# Altium schematic sheet uart.schdoc: UART
size A4; Date: 10.01.2026; CheckedBy: BCY; DrawnBy: miaow; Revision: v1.0.0; SheetNumber: 9; SheetTotal: 9; BoardType: MAIN_PCB; Desc: Debug & console
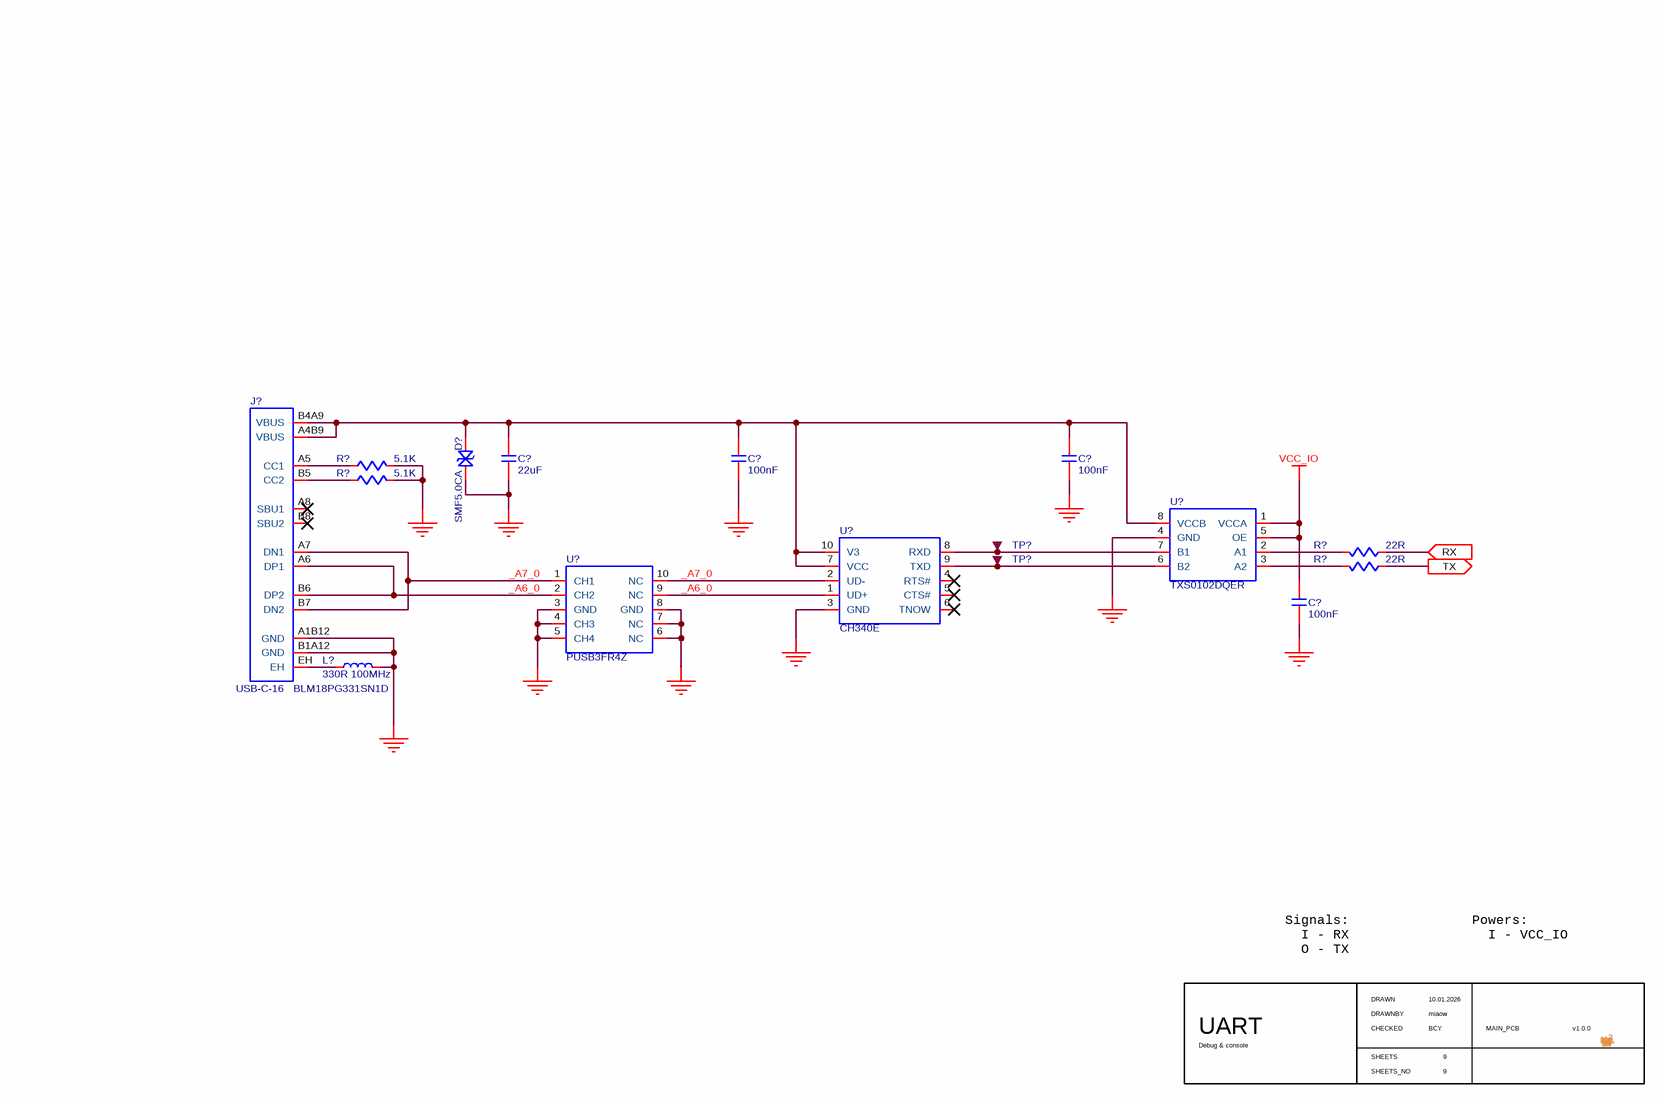
[diagram p0: uart.schdoc]

## Parts
(Parts that share a designator on the sheet are numbered #1, #2 ... from top to bottom, then left to right.)
C?#1  value 22uF  [C0603]  (hidden comment: C-NOMO)
C?#2  value 100nF  [C0402]  (hidden comment: C-NOMO)
C?#3  value 100nF  [C0402]  (hidden comment: C-NOMO)
C?#4  value 100nF  [C0402]  (hidden comment: C-NOMO)
D?  SMF5.0CA  [SMF5.0CA]
J?  USB-C-16  [USB-C-16]
L?  BLM18PG331SN1D  value 330R 100MHz  [L0603]
R?#1  value 5.1K  [R0402]  (hidden comment: R)
R?#2  value 5.1K  [R0402]  (hidden comment: R)
R?#3  value 22R  [R0402]  (hidden comment: R)
R?#4  value 22R  [R0402]  (hidden comment: R)
TP?#1  TP  [TP]  (value not drawn)
TP?#2  TP  [TP]  (value not drawn)
U?#1  TXS0102DQER  [TXS0102DQER]
U?#2  CH340E  [CH340E]
U?#3  PUSB3FR4Z  [PUSB3FR4Z]

## Ports
RX (in), TX (out)

## Nets
GND: C?#1.1 C?#2.1 C?#3.1 C?#4.1 D?.1 J?.A1B12(GND) J?.B1A12(GND) L?.2 R?#1.1 R?#2.1 U?#1.4(GND) U?#2.3(GND) U?#3.3(GND) U?#3.4(CH3) U?#3.5(CH4) U?#3.6(NC) U?#3.7(NC) U?#3.8(GND)
VCC_IO: C?#4.2 U?#1.1(VCCA) U?#1.5(OE)
_A6_0: J?.A6(DP1) J?.B6(DP2) U?#2.1(UD+) U?#3.2(CH2) U?#3.9(NC)
_A7_0: J?.A7(DN1) J?.B7(DN2) U?#2.2(UD-) U?#3.1(CH1) U?#3.10(NC)
RX: R?#3.2 ; port RX
TX: R?#4.2 ; port TX
NetC?#1_2: C?#1.2 C?#2.2 C?#3.2 D?.2 J?.A4B9(VBUS) J?.B4A9(VBUS) U?#1.8(VCCB) U?#2.7(VCC) U?#2.10(V3)
NetJ?_A5: J?.A5(CC1) R?#1.2
NetJ?_B5: J?.B5(CC2) R?#2.2
NetJ?_EH: J?.EH L?.1
NetR?#3_1: R?#3.1 U?#1.2(A1)
NetR?#4_1: R?#4.1 U?#1.3(A2)
NetTP?#1_0: TP?#1.0 U?#1.7(B1) U?#2.8(RXD)
NetTP?#2_0: TP?#2.0 U?#1.6(B2) U?#2.9(TXD)

Not connected (* = marked no-connect by the designer): J? A8(SBU1)* B8(SBU2)*; U?#2 4(RTS#)* 5(CTS#)* 6(TNOW)*

## Notes on the sheet
- Signals:
  I - RX
  O - TX
- Powers:
  I - VCC_IO
- DRAWN
- CHECKED
- DRAWNBY
- SHEETS
- SHEETS_NO

## Library data of the parts
C?#1 = C-NOMO: voltage: 10V; precision: 5%
C?#2-C?#4 = C-NOMO: voltage: 16V; precision: 5%
D? = SMF5.0CA: TVS/ESD; Supplier 1: LCSC; Supplier Part Number 1: C19077498
L? = L: Code_IEC: 1005; Published: 8-Jun-2000; LatestRevisionDate: 29-May-2009; LatestRevisionNote: IPC-7351 Footprint Added.; PackageReference: 0402-A; Publisher: Altium Limited; PackageDescription: Chip Inductor; Code_JEITA: 0402; Supplier 1: LCSC; Supplier Part Number 1: C79913
R?#1-R?#4 = R: precision: 1%
U?#1 = TXS0102DQER: LEVEL SHIFT - 2bits, autodir, 1.65V - 3.6V, 2.3V - 5.5V, 24Mbps; Supplier Part Number 1: C2652935; Supplier 1: LCSC
U?#2 = CH340E: USB UART; Supplier 1: LCSC; Supplier Part Number 1: C99652
U?#3 = PUSB3FR4Z: TVS/ESD - USB, HDMI; Supplier 1: LCSC; Supplier Part Number 1: C503418
J? = USB-C-16: Supplier 1: LCSC; Supplier Part Number 1: C165948